# EAGLE board booz_main (EAGLE 6.1)
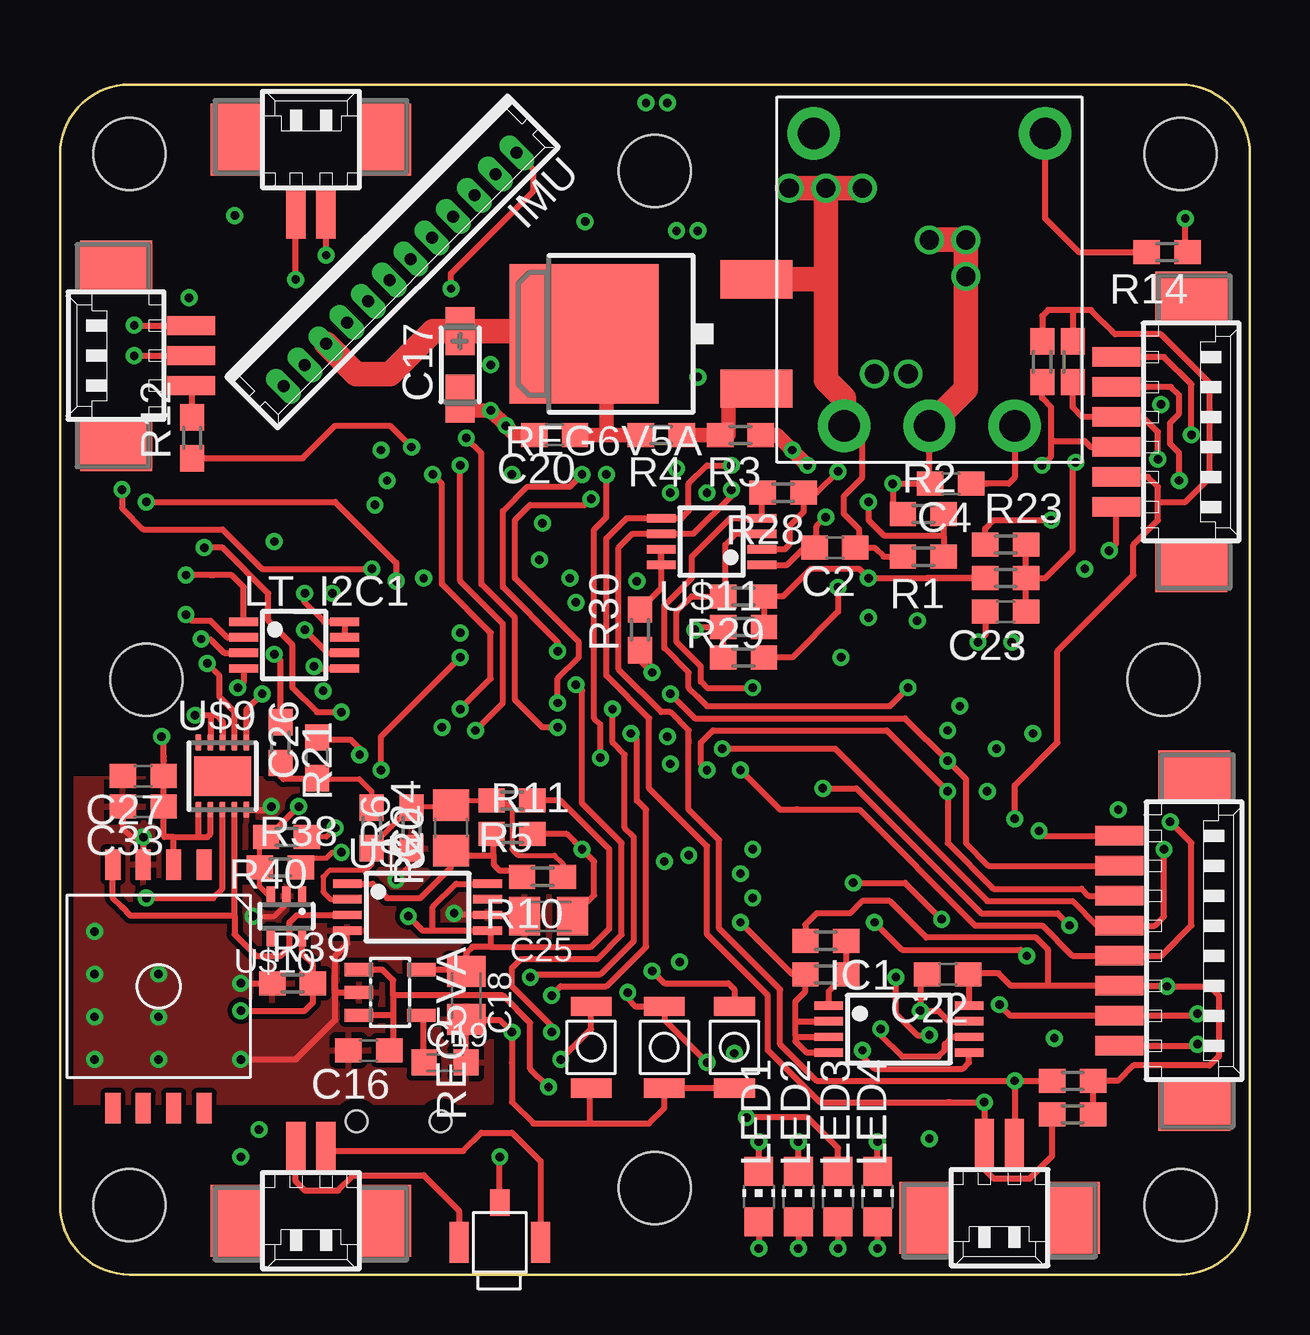
[diagram p3: board, top side]
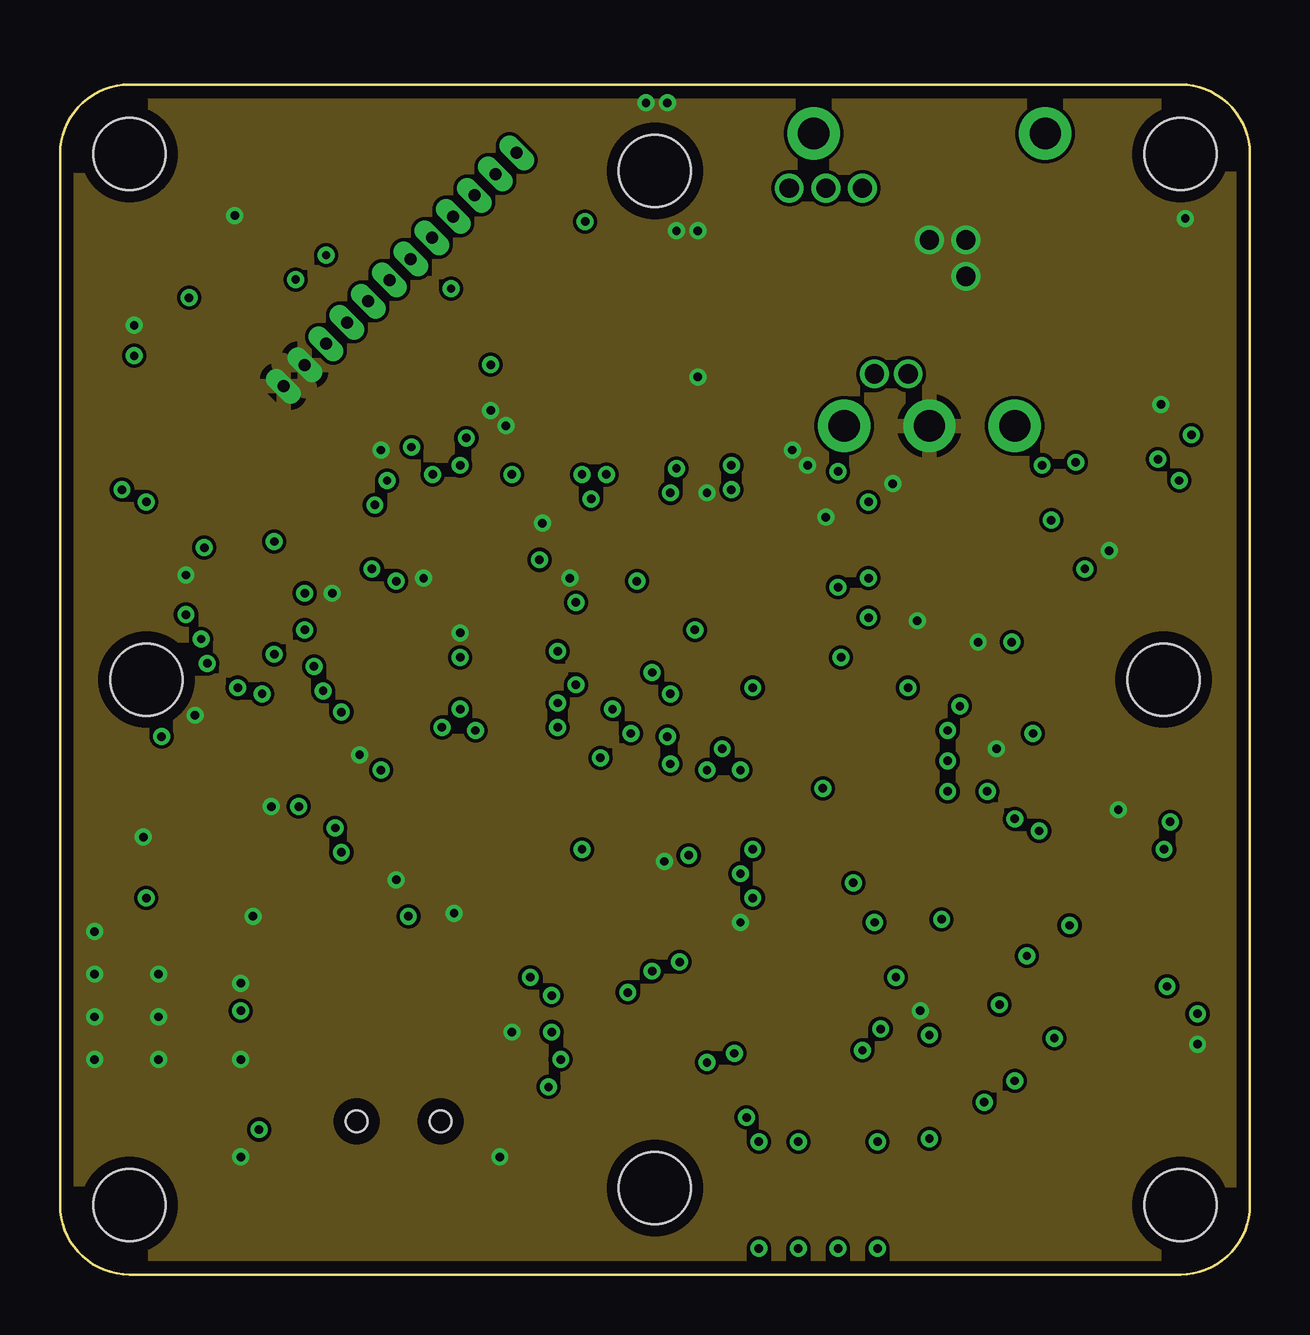
[diagram p4: board, inner layer Route2]
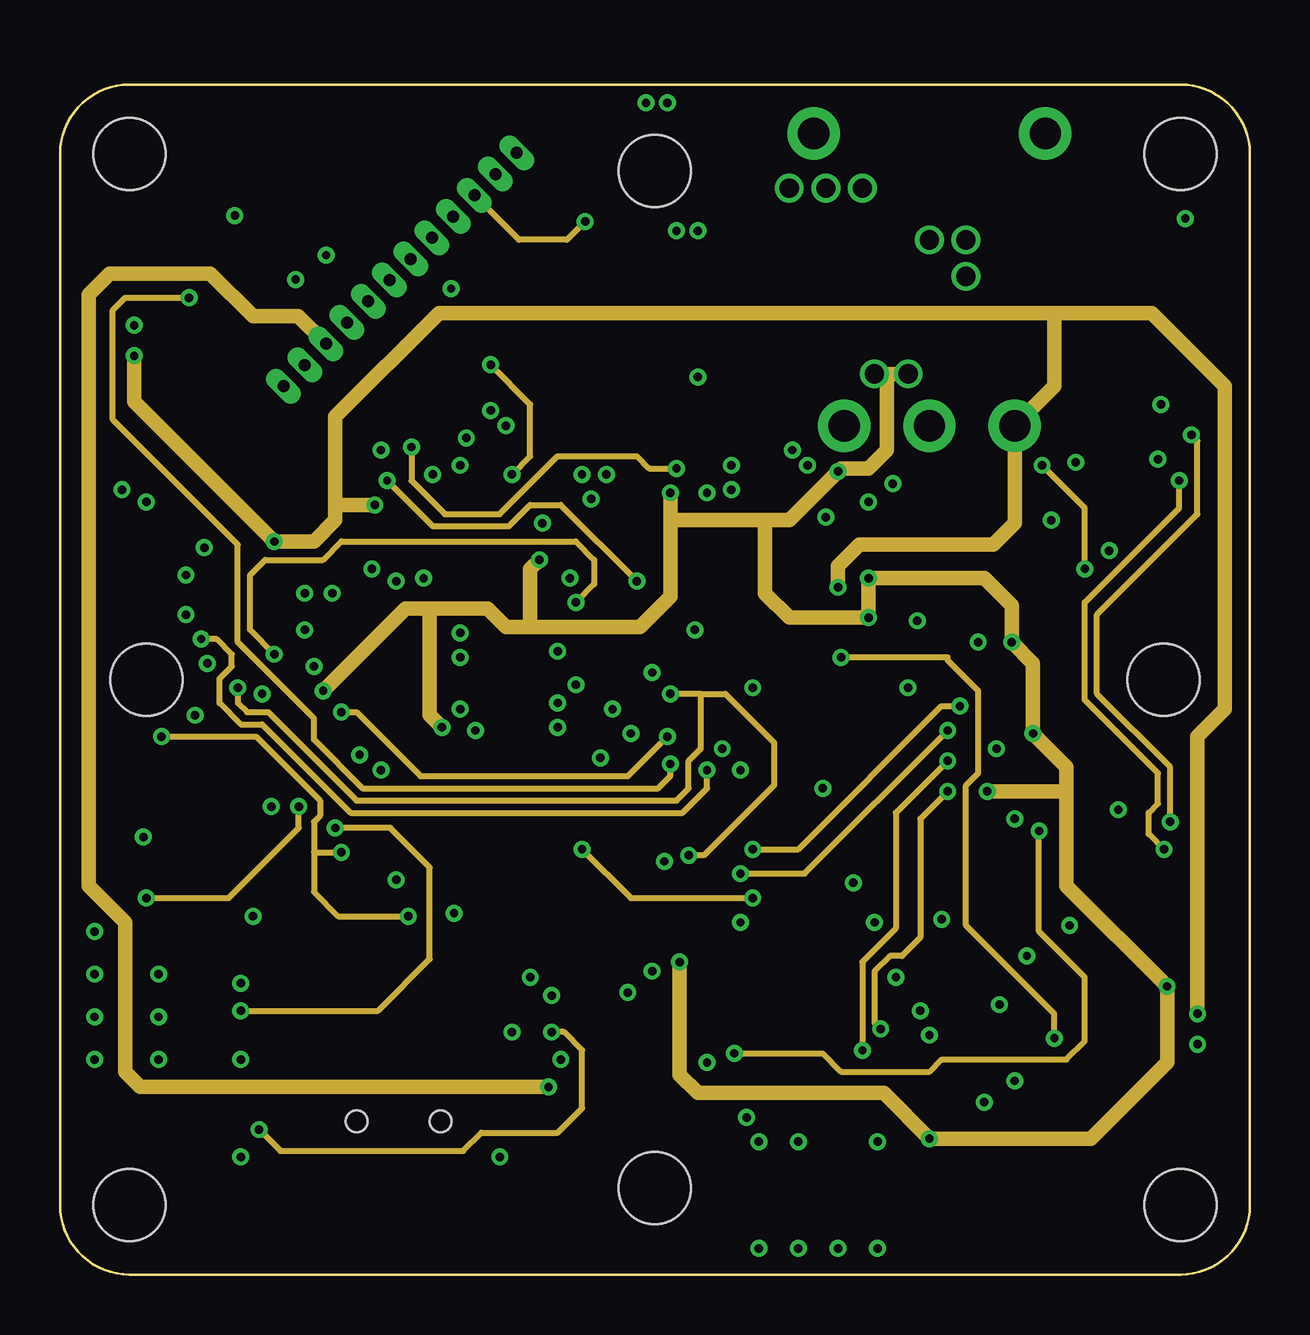
[diagram p5: board, inner layer Route15]
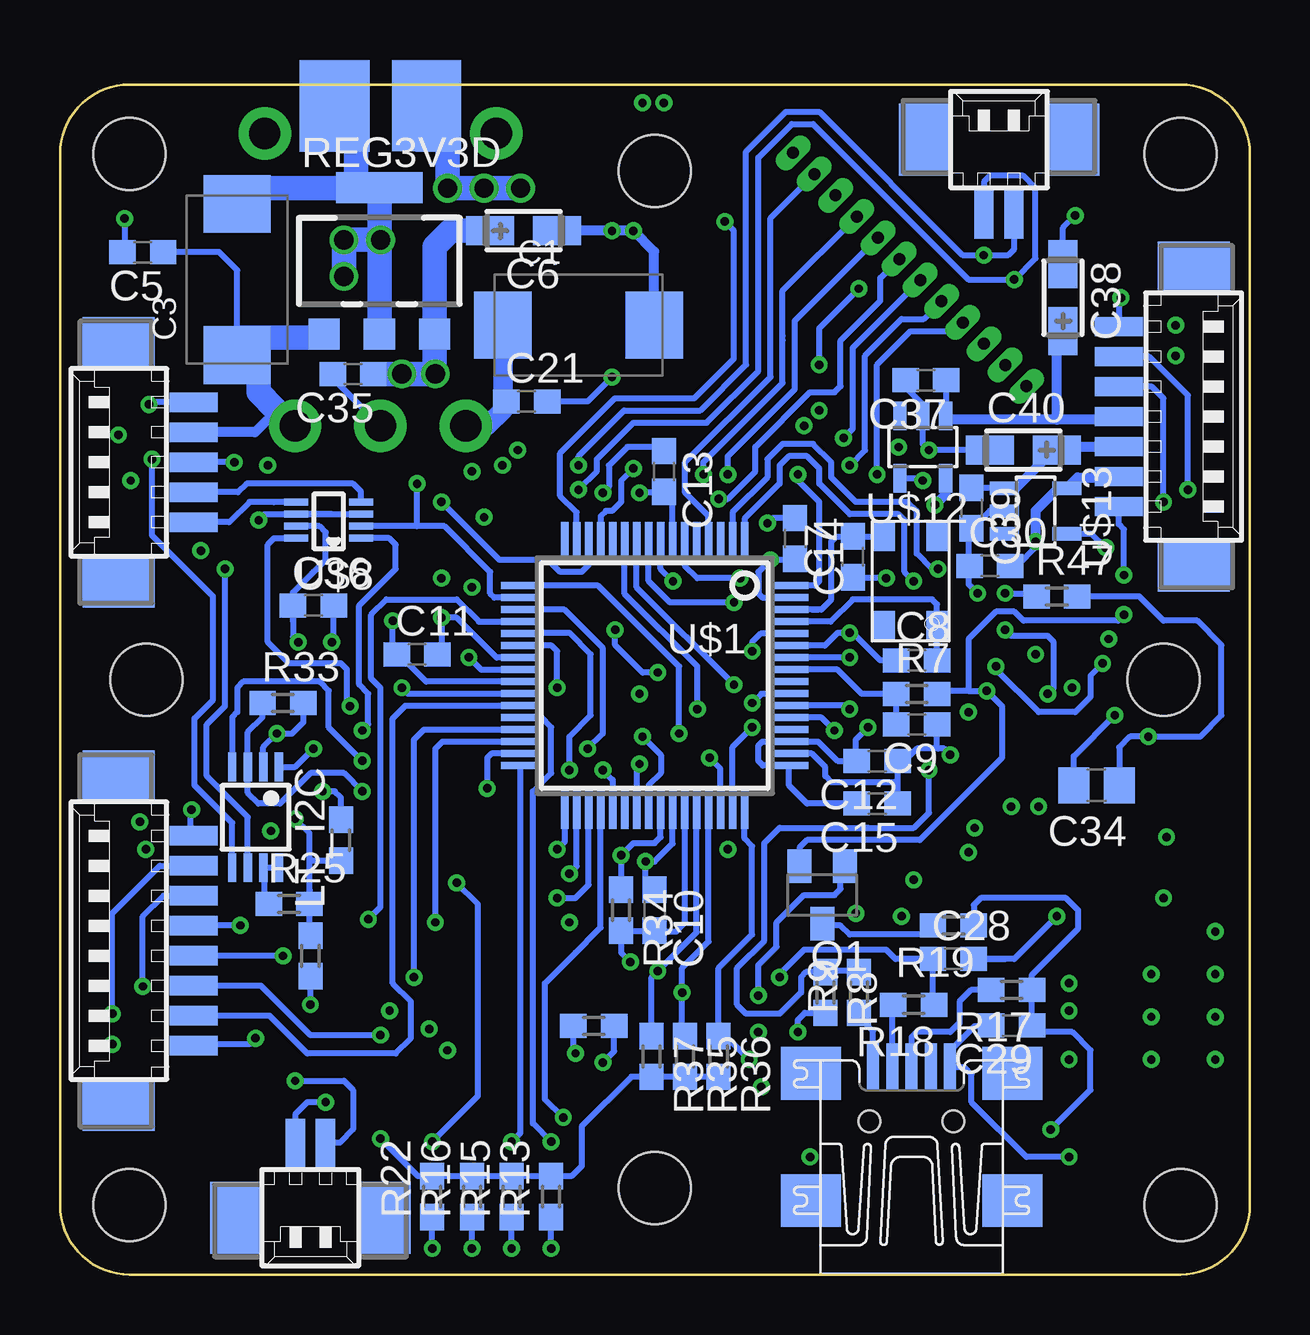
[diagram p6: board, bottom side, seen from below]

Size 49.6 x 49.6 mm. Coordinates in mm from the lower left corner, seen from the top.
Outline: 0,2.9 0,46.7 arc-90 2.9,49.6 46.7,49.6 arc-90 49.6,46.7 49.6,2.9 arc-90 46.7,0 2.9,0 arc-90 0,2.9
Copper layers (1*2+15*16): Top 0.035mm / dielectric 0.2mm / Route2 0.035mm / dielectric 1.5mm / Route15 0.035mm / dielectric 0.2mm / Bottom 0.035mm
Design rules: minimum track width 0.15mm, minimum drill 0.35mm, track to track 0.15mm, track to pad 0.15mm, pad to pad 0.15mm, via to via 0.15mm, smd to smd 0.15mm, copper to edge 20mil, drill to drill 8mil, minimum pad ring 0.177mm, minimum via ring 0.177mm, stop-mask expansion 4mil, vias tented up to drill 14mil, thermal gap 10mil
Holes 3 mm at 2.9,46.7 46.7,46.7 2.9,2.9 46.7,2.9 24.8,46 46,24.8 24.8,3.6 3.6,24.8
bKeepout: area 36.8,36.8 to 42.8,42.8; area 36.8,6.8 to 42.8,12.8; area 6.8,6.8 to 12.8,12.8; area 6.8,36.8 to 12.8,42.8
tRestrict: area -0.2,43.6 to 6,49.8; area 43.7,43.7 to 49.9,49.9; area 43.6,-0.2 to 49.8,6; area -0.2,-0.2 to 6,6; area 21.7,43 to 27.9,49.2; area 42.9,21.7 to 49.1,27.9; area 0.5,21.7 to 6.7,27.9; area 21.8,0.7 to 28,6.9

## Footprints (pad centres in the part's own frame; a part is rotated, then mirrored left to right if it is on the bottom)
SOLD_PAD_150_75 = smd 3.81 x 1.905: P$1 0,0
SMC_D = smd 2.4 x 2.8: + -3.15,0; - 3.15,0
C0603 = smd 1.1 x 1: 1 -0.85,0; 2 0.85,0
CT3216 = smd 2 x 1.2: + 1.4,0; - -1.4,0
C0805K = smd 1.3 x 1.6: 1 -1,0; 2 1,0
C0603K = smd 1.05 x 1.08: 1 -0.875,0; 2 0.875,0
C0805 = smd 1.3 x 1.5: 1 -0.95,0; 2 0.95,0
53261-07 = smd 0.8 x 2: 1 3.75,-2.5; 2 2.5,-2.5; 3 1.25,-2.5; 4 0,-2.5; 5 -1.25,-2.5; 6 -2.5,-2.5; 7 -3.75,-2.5 | smd 2.1 x 3: S1 6.25,0.625; S2 -6.25,0.625
53261-08 = smd 0.8 x 2: 1 4.375,-2.5; 2 3.125,-2.5; 3 1.875,-2.5; 4 0.625,-2.5; 5 -0.625,-2.5; 6 -1.875,-2.5; 7 -3.125,-2.5; 8 -4.375,-2.5 | smd 2.1 x 3: S1 6.875,0.625; S2 -6.875,0.625
TSSOP8 = smd 0.35 x 1.2: 1 -0.975,-2.925; 2 -0.325,-2.925; 3 0.325,-2.925; 4 0.975,-2.925; 5 0.975,2.925; 6 0.325,2.925; 7 -0.325,2.925; 8 -0.975,2.925
53047-12 = drill 0.5 pad 0.698 long: 1 6.875,0.45; 2 5.625,0.45; 3 4.375,0.45; 4 3.125,0.45; 5 1.875,0.45; 6 0.625,0.45; 7 -0.625,0.45; 8 -1.875,0.45; 9 -3.125,0.45; 10 -4.375,0.45; 11 -5.625,0.45; 12 -6.875,0.45
CHIP-LED0805 = smd 1.2 x 1.2: A 0,-1.05; C 0,1.05
TSSOP_B3 = smd 1.2 x 0.35: 1 -2.925,0.975; 2 -2.925,0.325; 3 -2.925,-0.325; 4 -2.925,-0.975; 5 1.275,-0.975; 6 1.275,-0.325; 7 1.275,0.325; 8 1.275,0.975
53261-02 = smd 0.8 x 2: 1 0.625,-2.5; 2 -0.625,-2.5 | smd 2.1 x 3: S1 3.125,0.625; S2 -3.125,0.625
SC59-BEC = smd 1 x 1.4: B -0.95,-1.2; C 0,1.2; E 0.95,-1.2
R0603 = smd 1.1 x 1: 1 -0.85,0; 2 0.85,0
53261-03 = smd 0.8 x 2: 1 1.25,-2.5; 2 0,-2.5; 3 -1.25,-2.5 | smd 2.1 x 3: S1 3.75,0.625; S2 -3.75,0.625
SOT223-R = smd 1.3 x 1.3: 1 -2.3,-3.05; 2 0,-3.05; 3 2.3,-3.05 | smd 3.6 x 1.3: 4 0,3.05
SOT23-5 = smd 0.55 x 1.2: 1 -0.95,-1.3; 2 0,-1.3; 3 0.95,-1.3; 4 0.95,1.3; 5 -0.95,1.3
PTH_TH = drill 1.3 pad 2.184: P$1 -6.096,3.556; P$2 -6.096,0; P$3 -6.096,-3.556; P$4 6.096,-4.826; P$5 6.096,4.826
DPACK = smd 1.6 x 3: 1 -2.28,-4.8; 3 2.28,-4.8 | smd 5.8 x 6.2: 4 0,2.38
SQFP-S-10X10-64 = smd 0.3 x 1.6: 1 -3.75,-5.6; 2 -3.25,-5.6; 3 -2.75,-5.6; 4 -2.25,-5.6; 5 -1.75,-5.6; 6 -1.25,-5.6; 7 -0.75,-5.6; 8 -0.25,-5.6; 9 0.25,-5.6; 10 0.75,-5.6; 11 1.25,-5.6; 12 1.75,-5.6; 13 2.25,-5.6; 14 2.75,-5.6; 15 3.25,-5.6; 16 3.75,-5.6; 33 3.75,5.6; 34 3.25,5.6; 35 2.75,5.6; 36 2.25,5.6; 37 1.75,5.6; 38 1.25,5.6; 39 0.75,5.6; 40 0.25,5.6; 41 -0.25,5.6; 42 -0.75,5.6; 43 -1.25,5.6; 44 -1.75,5.6; 45 -2.25,5.6; 46 -2.75,5.6; 47 -3.25,5.6; 48 -3.75,5.6 | smd 1.6 x 0.3: 17 5.6,-3.75; 18 5.6,-3.25; 19 5.6,-2.75; 20 5.6,-2.25; 21 5.6,-1.75; 22 5.6,-1.25; 23 5.6,-0.75; 24 5.6,-0.25; 25 5.6,0.25; 26 5.6,0.75; 27 5.6,1.25; 28 5.6,1.75; 29 5.6,2.25; 30 5.6,2.75; 31 5.6,3.25; 32 5.6,3.75; 49 -5.6,3.75; 50 -5.6,3.25; 51 -5.6,2.75; 52 -5.6,2.25; 53 -5.6,1.75; 54 -5.6,1.25; 55 -5.6,0.75; 56 -5.6,0.25; 57 -5.6,-0.25; 58 -5.6,-0.75; 59 -5.6,-1.25; 60 -5.6,-1.75; 61 -5.6,-2.25; 62 -5.6,-2.75; 63 -5.6,-3.25; 64 -5.6,-3.75
CASE_1317 = smd 1.27 x 0.635: P$1 5.08,-1.905; P$2 5.08,-0.635; P$3 5.08,0.635; P$4 5.08,1.905; P$5 -5.08,1.905; P$6 -5.08,0.635; P$7 -5.08,-0.635; P$8 -5.08,-1.905
B3U-3100P = smd 0.8 x 1.1: GND 0,-1.65 | smd 0.8 x 1.7: P$1 -1.7,0; P$2 1.7,0
CTS_CRYSTAL = smd 1.2 x 0.9: P$1 -1.85,-1.1; P$2 1.85,-1.1; P$3 1.85,1.1; P$4 -1.85,1.1
B3U-1000P = smd 0.8 x 1.7: P$1 -1.7,0; P$2 1.7,0
US8 = smd 0.3 x 1: 1 -0.75,-1.35; 2 -0.25,-1.35; 3 0.25,-1.35; 4 0.75,-1.35; 5 0.75,1.35; 6 0.25,1.35; 7 -0.25,1.35; 8 -0.75,1.35
DFN10 = smd 0.25 x 0.675: 1 -1,-1.4; 2 -0.5,-1.4; 3 0,-1.4; 4 0.5,-1.4; 5 1,-1.4; 6 1,1.4; 7 0.5,1.4; 8 0,1.4; 9 -0.5,1.4; 10 -1,1.4 | smd 2.38 x 1.65: 11 0,0
SC70-5L = smd 0.35 x 0.8: 1 -0.65,-0.85; 2 0,-0.85; 3 0.65,-0.85; 4 0.65,0.85; 5 -0.65,0.85
SOT23-5L = smd 0.55 x 1.2: 1 -0.95,-1.3; 2 0,-1.3; 3 0.95,-1.3; 4 0.95,1.3; 5 -0.95,1.3
53261-06 = smd 0.8 x 2: 1 3.125,-2.5; 2 1.875,-2.5; 3 0.625,-2.5; 4 -0.625,-2.5; 5 -1.875,-2.5; 6 -3.125,-2.5 | smd 2.1 x 3: S1 5.625,0.625; S2 -5.625,0.625
53261-05 = smd 0.8 x 2: 1 2.5,-2.5; 2 1.25,-2.5; 3 0,-2.5; 4 -1.25,-2.5; 5 -2.5,-2.5 | smd 2.1 x 3: S1 5,0.625; S2 -5,0.625
UX60-MB-5ST = smd 2 x 0.5: 1 2.25,1.6; 2 2.25,0.8; 3 2.25,0; 4 2.25,-0.8; 5 2.25,-1.6 | smd 2.2 x 2.5: M1 -3.3,-4.2; M2 -3.3,4.2; M3 2,4.2; M4 2,-4.2 | hole 0.9: 0,-1.75; 0,1.75

## Placement (x,y rotation side)
BAT_IN  SOLDER_PAD150_75  [SOLD_PAD_150_75]  34.8,48.72 270 bottom
BAT_IN1  SOLDER_PAD150_75  [SOLD_PAD_150_75]  33.83,48.71 270 bottom
C1  100uF/20V  [SMC_D]  27.98,39.57 0 bottom
C2  100nF  [C0603]  32.3,30.3 180 top
C3  220uF/10V  [SMC_D]  42.21,41.47 90 bottom
C4  100nF  [C0603]  37.13,32.97 180 top
C5  100nF  [C0603]  46.15,42.62 180 bottom
C6  33uF/6V  [CT3216]  30.27,43.51 180 bottom
C7  18pF  [C0603]  16.55,29.92 90 bottom
C8  18pF  [C0603]  13.89,25.6 0 bottom
C9  100nF  [C0603]  13.89,22.93 180 bottom
C10  100nF  [C0603]  24.81,15.19 270 bottom
C11  100nF  [C0603]  34.72,25.85 0 bottom
C12  100nF  [C0603]  15.54,21.41 180 bottom
C13  100nF  [C0603]  24.43,33.47 270 bottom
C14  100nF  [C0603]  18.97,30.68 270 bottom
C15  100nF  [C0603]  15.54,19.63 180 bottom
C16  2.2uF/Low ESR  [C0603]  12.87,9.34 180 top
C17  22uF/10V  [CT3216]  16.68,37.92 90 top
C18  4.7uF/10V/Low ESR  [C0805K]  16.94,11.63 270 top
C19  10nF/16V  [C0603K]  16.05,8.84 0 top
C20  100nF  [C0603]  20.62,35 180 top
C21  100nF  [C0603]  30.14,36.39 0 bottom
C22  100nF  [C0603]  37,12.52 180 top
C23  100nF  [C0603]  39.41,27.63 180 top
C24  1.5uF  [C0805]  16.3,18.61 90 top
C25  33nF  [C0805K]  20.36,14.93 180 top
C26  100nF  [C0603]  10.71,21.54 90 top
C27  100nF  [C0603]  3.47,20.77 180 top
C28  18pF  [C0603]  12.36,13.15 0 bottom
C29  18pF  [C0603]  9.94,10.39 180 bottom
C30  100nF  [C0603]  10.84,29.54 0 bottom
C33  100nF  [C0603]  3.47,19.5 180 top
C34  1.5uF  [C0805]  6.39,20.39 180 bottom
C35  100nF  [C0603]  37.38,37.54 180 bottom
C36  100nF  [C0603]  39.03,27.89 0 bottom
C37  100nF  [C0603]  13.51,37.28 180 bottom
C38  33uF/6V  [CT3216]  7.79,40.71 270 bottom
C39  100nF  [C0603]  11.6,31.95 270 bottom
C40  33uF/6V  [CT3216]  9.44,34.36 0 bottom
CAM  53261-07  [53261-07]  2.97,35.76 270 bottom
GND_IN  SOLDER_PAD150_75  [SOLD_PAD_150_75]  37.64,48.71 270 bottom
GND_IN1  SOLDER_PAD150_75  [SOLD_PAD_150_75]  38.65,48.71 90 bottom
GPS  53261-08  [53261-08]  46.65,13.92 270 top
IC1  24AA128ST  [TSSOP8]  34.97,10.23 270 top
IMU  53047-12  [53047-12]  13.86,42.21 225 top
LED1  RED  [CHIP-LED0805]  29.13,3.25 0 top
LED2  RED  [CHIP-LED0805]  30.78,3.25 0 top
LED3  RED  [CHIP-LED0805]  32.43,3.25 0 top
LED4  RED  [CHIP-LED0805]  34.08,3.25 0 top
LT_I2C  PCA9306DP  [TSSOP_B3]  41.45,18.23 270 bottom
LT_I2C1  PCA9306DP  [TSSOP_B3]  10.59,26.24 0 top
MC1  53261-02  [53261-02]  39.16,2.99 180 bottom
MC2  53261-02  [53261-02]  39.16,2.99 180 top
MC3  53261-02  [53261-02]  10.46,46.68 0 top
MC4  53261-02  [53261-02]  10.46,46.68 0 bottom
PS  53261-02  [53261-02]  10.46,2.87 180 top
Q1  DDTA143  [SC59-BEC]  17.83,15.82 180 bottom
R1  4.7k  [R0603]  35.99,29.92 180 top
R2  1k  [R0603]  35.99,31.7 0 top
R3  3.9k  [R0603]  28.37,35 180 top
R4  1k  [R0603]  25.06,35 180 top
R5  390R  [R0603]  18.84,19.76 180 top
R6  12K  [R0603]  14.65,18.61 90 top
R7  10k  [R0603]  13.89,24.2 0 bottom
R8  3.3k  [R0603]  17.7,11.76 270 bottom
R9  1.8k  [R0603]  16.3,11.76 90 bottom
R10  27K  [R0603]  20.11,16.58 180 top
R11  120k  [R0603]  18.84,18.36 0 top
R12  100R  [R0603]  5.51,34.87 90 top
R13  1k  [R0603]  29.13,3.25 90 bottom
R14  348R  [R0603]  46.15,42.62 180 top
R15  1k  [R0603]  30.78,3.25 90 bottom
R16  1k  [R0603]  32.43,3.25 90 bottom
R17  33R  [R0603]  9.94,11.86 180 bottom
R18  33R  [R0603]  14.02,11.25 180 bottom
R19  1.5k  [R0603]  12.36,14.55 180 bottom
R20  560R  [R0603]  13,18.61 270 top
R21  680R  [R0603]  9.19,22.17 270 top
R22  1k  [R0603]  34.08,3.25 90 bottom
R23  100  [R0603]  39.41,30.43 0 top
R24  0/DNP  [R0603]  39.41,29.03 0 top
R25  200k  [R0603]  40.05,15.44 0 bottom
R26  0/DNP  [R0603]  37.89,18.11 270 bottom
R27  0/DNP  [R0603]  39.16,13.28 90 bottom
R28  4.7k  [R0603]  30.14,32.58 180 top
R29  4.7k  [R0603]  28.49,28.27 180 top
R30  200k  [R0603]  24.17,26.87 90 top
R31  0/DNP  [R0603]  28.49,27 180 top
R32  0/DNP  [R0603]  28.49,25.73 180 top
R33  4.7k  [R0603]  40.3,23.82 0 bottom
R34  4.7k  [R0603]  26.21,15.19 270 bottom
R35  10k  [R0603]  23.54,9.09 270 bottom
R36  10k  [R0603]  22.14,9.09 270 bottom
R37  10k  [R0603]  24.94,9.09 270 bottom
R38  RS  [R0603]  9.19,16.96 0 top
R39  R2  [R0603]  9.7,12.14 0 top
R40  R1  [R0603]  9.44,18.23 180 top
R41  0/DNP  [R0603]  31.92,13.92 0 top
R42  0/DNP  [R0603]  31.92,12.52 0 top
R43  4.7k  [R0603]  42.21,38.05 90 top
R44  4.7k  [R0603]  40.94,38.05 90 top
R45  4.7k  [R0603]  42.21,8.07 180 top
R46  4.7k  [R0603]  42.21,6.68 180 top
R47  200k  [R0603]  8.05,28.27 0 bottom
R48  0/DNP  [R0603]  27.35,10.36 180 bottom
RC  53261-03  [53261-03]  2.97,38.3 90 top
REG3V3D  LM3940IMP-3.3  [SOT223-R]  36.29,42.25 0 bottom
REG5VA  LP2992  [SOT23-5]  13.76,11.76 270 top
REG5VD  PTHTH  [PTH_TH]  36.24,41.47 90 top
REG6V5A  LM317MBDT  [DPACK]  24.22,39.21 90 top
SPI_0  53261-08  [53261-08]  46.53,13.92 90 bottom
U$1  LPC2148  [SQFP-S-10X10-64]  24.81,24.96 180 bottom
U$2  MPX6115  [CASE_1317]  4.11,12.01 90 top
U$3  SW_PB_GNDRT/A  [B3U-3100P]  18.33,1.34 180 top
U$4  CRYSTAL_CTS  [CTS_CRYSTAL]  14.14,28.9 270 bottom
U$5  AD8552RU  [TSSOP8]  14.9,15.31 270 top
U$6  SW_PBST  [B3U-1000P]  25.19,9.47 270 top
U$7  SW_PBST  [B3U-1000P]  22.14,9.47 270 top
U$8  TXS0102DCU  [US8]  38.4,31.44 90 bottom
U$9  LTC2485  [DFN10]  6.78,20.77 0 top
U$10  LM4041SC70  [SC70-5L]  9.44,14.93 180 top
U$11  PCA9306DP  [TSSOP_B3]  26.33,30.55 180 top
U$12  TPS2051B  [SOT23-5L]  13.63,34.49 180 bottom
U$13  TPS2051B  [SOT23-5L]  8.94,31.82 270 bottom
U$14  SW_PBST  [B3U-1000P]  28.11,9.47 270 top
UART_0  53261-06  [53261-06]  46.53,35.12 270 top
UART_1  53261-05  [53261-05]  46.53,33.86 90 bottom
USB  MINI-USB-UX60-MB-5ST  [UX60-MB-5ST]  14.1,6.38 90 bottom

## Tracks (layer width: path | path; a pad name or v marks a point on that pad's centre or on a via)
+3V3  (via drill 0.35, 0.8)
  Top 0.254: R31.1 29.34,28.23 29.38,28.27 R29.1 30.14,28.27 31.29,29.41 33.32,29.41 v33.7,29.03 R24.1 36.11,29.03 | U$11.2 30.2,30.23 30.4,30.43 30.4,31.19 30.99,31.78 R28.1 31.54,32.58 v32.43,33.47 | 37.89,12.56 IC1.8 | 37.89,12.56 C22.1 | 41.19,12.04 GPS.3 44.18,12.01 v46.15,12.01 47.92,12.01 48.3,11.63 48.3,9.09 47.92,8.71 44.75,8.71 44.11,8.07 R45.1 R46.1 | 41.19,12.04 39.64,12.04 39.12,12.56 37.89,12.56 | R41.1 31.07,14.59 31.54,15.06 32.94,15.06 33.45,15.57 34.59,15.57 36.11,14.04 40.69,14.04 41.19,13.54 41.19,12.04 | LT_I2C1.2 6.96,26.56 6.27,27.25 5.51,27.25 v5.25,27.5
  Route15 0.61: 41.95,17.35 41.95,20.14 | 41.95,17.35 41.95,17.22 | 41.95,20.14 41.95,21.15 v40.56,22.55 40.56,25.47 v39.67,26.36 39.67,27.89 38.53,29.03 v33.7,29.03 v33.7,27.38 30.4,27.38 29.38,28.39 29.38,31.44 | 41.95,20.14 v38.65,20.14 | 29.38,31.44 25.44,31.44 | 29.38,31.44 30.4,31.44 v32.43,33.47 32.56,33.6 33.7,33.6 34.46,34.36 34.46,37.54 v33.95,37.54 v35.35,37.54 | 25.44,31.44 25.44,28.27 24.17,27 19.6,27 | 25.44,31.44 v25.44,32.58 | 41.95,17.35 41.95,16.2 v46.15,12.01 46.15,8.84 42.97,5.66 v36.24,5.66 34.33,7.57 26.59,7.57 25.83,8.33 v25.83,13.03 | 19.6,27 19.6,29.41 v19.98,29.79 | v10.97,24.33 14.4,27.76 15.41,27.76 | 15.41,27.76 17.83,27.76 18.59,27 19.6,27 | v15.92,22.81 15.41,23.31 15.41,27.76
  Bottom 0.254: 16.43,21.41 17.19,21.41 18,22.21 U$1.51 20.32,22.21 20.49,22.04 20.49,21.41 20.3,21.21 U$1.49 19.21,20.38 18.46,19.63 C15.2 | LT_I2C.2 41.12,21.99 v40.56,22.55 39.92,22.55 39.45,23.02 R33.2 | 30.42,25.73 U$1.23 31.4,25.71 33.06,27.38 v33.7,27.38 33.7,26.02 C11.2 | U$1.43 23.54,19.38 23.54,14.68 23.92,14.3 24.81,14.3 | 24.43,32.58 C13.2 | U$1.7 24.06,32.22 24.43,32.58 | 16.43,21.41 C12.2 | v15.92,22.81 16.43,22.3 16.43,21.41 | R15.2 R13.2 28.28,4.1 27.86,4.52 27.86,6.17 25.79,8.24 R37.2 R35.2 R36.2 | R15.2 R16.2 R22.2 | 24.43,32.58 v25.44,32.58 | R15.2 30.78,3.76 30.74,3.72 | R22.2 34.08,3.76 34.04,3.72 | 39.03,29.28 38.53,29.79 38.53,30.93 38.78,31.19 U$8.7 | 39.03,29.28 39.12,29.2 | C10.2 24.81,14.3 | Q1.E 18.77,17.79 18.46,18.11 13.76,18.11 10.33,21.54 10.33,23.7 v10.97,24.33 11.73,24.33 | 26.21,14.3 R34.2 | 24.81,14.3 26.21,14.3 | 39.88,27.23 39.88,26.58 v39.67,26.36 | C36.1 39.88,27.23 | SPI_0.3 45.29,15.79 46.15,14.93 v46.15,12.01 | 39.88,27.23 39.88,28.43 39.03,29.28 | U$1.63 20.31,28.21 20.49,28.39 20.49,29.28 v19.98,29.79 19.01,29.79 arc-90 C14.2 | R7.2 12.91,24.33 11.73,24.33 | v5.25,27.5 5.51,27.25 9.44,27.25 9.82,27.63 10.59,27.63 11.73,26.49 11.73,24.33 | R22.2 34.68,4.1 v36.24,5.66 | R26.1 37.89,19.89 38.14,20.14 v38.65,20.14 | 26.21,14.3 26.21,13.41 v25.83,13.03
  Bottom 0.813: v33.95,37.54 33.99,37.57 | v35.35,37.54 34.72,37.54
  Bottom 1.016: 33.99,37.57 REG3V3D.3 33.99,42.84 33.32,43.51 C6.+ | v33.95,37.54 34.72,37.54 C35.1
+5V  (via drill 0.35)
  Top 0.254: R32.1 30.52,25.73 32.43,27.63 v32.43,28.65 | REG5VD.P$3 39.8,33.22 39.54,32.97 C4.1 38.65,32.97 | v3.09,38.3 RC.2 | v47.42,10.87 47.34,10.79 GPS.2 39.62,10.79 v39.16,11.25
  Route15 0.61: v3.09,38.3 3.09,36.39 v8.94,30.55 10.59,30.55 11.47,31.44 11.47,32.08 | v47.42,10.87 47.42,22.43 48.56,23.57 48.56,37.03 45.51,40.08 41.45,40.08 | 11.47,32.08 11.47,35.76 15.79,40.08 41.45,40.08 | v32.43,28.65 32.43,29.54 33.32,30.43 38.91,30.43 39.8,31.32 REG5VD.P$3 | 11.47,32.08 v13.13,32.08 | REG5VD.P$3 | REG5VD.P$3 | REG5VD.P$3 41.45,37.03 41.45,40.08
  Bottom 0.254: 5.39,33.22 CAM.2 | v39.16,11.25 R27.1 | U$13.5 7.98,32.77 | C30.2 9.7,29.54 8.94,30.3 v8.94,30.55 | v47.42,10.87 47.42,15.06 45.43,17.04 SPI_0.2 | C5.1 42.97,42.62 42.21,41.86 42.21,39.06 | 40.43,36.14 40.56,36.14 40.62,36.08
  Bottom 0.406: U$13.5 7.19,33.22 5.39,33.22 | 7.98,32.77 8.94,31.82 v8.94,30.55 | U$12.5 12.68,32.52 v13.13,32.08 | 40.62,36.08 40.56,36.01 | UART_1.2 41.47,35.11 40.43,36.14 | 41.32,38.33 41.68,38.33 41.83,38.17
  Bottom 1.016: 38.53,39.19 38.59,39.19 REG3V3D.1 38.59,39.06 42.21,39.06 C3.+ 41.32,38.33 41.32,36.78 40.62,36.08 39.92,35.38 REG5VD.P$3
+5VA  (via drill 0.35)
  Top 0.203: v11.73,17.6 11.35,17.6 11.09,17.35 10.46,17.35 10.08,16.96 R38.2
  Top 0.254: 5.25,18.23 5.28,18.23 | 5.25,18.23 5.76,18.23 | 4.74,18.23 4.36,18.23 4.32,18.27 4.32,19.12 | 4.74,18.23 5.25,18.23 | 16.94,13.41 16.97,13.45 | 4.32,19.12 C33.1 | C33.1 C27.1 4.32,21.41 | 4.32,19.12 4.36,19.12 4.32,19.16 C33.1 | 4.32,21.41 4.32,21.57 | 4.32,21.41 4.32,22.34 v4.24,22.43 | 5.76,18.23 6.14,18.23 6.28,18.37 U$9.2 | U$9.1 5.78,18.25 5.76,18.23 | REG5VA.5 16.37,12.71 16.68,12.39 16.94,12.65 | 17.44,13.66 17.19,13.66 16.94,13.41 | 17.44,13.66 17.45,13.67 | U$2.P$2 4.74,18.23 | 17.95,13.66 17.44,13.66 | 17.95,13.66 22.14,13.66 22.91,14.42 22.91,17.73 20.87,19.76 R5.1 | U$5.8 16.51,16.29 15.54,15.31 15.54,14.34 | 15.54,14.34 15.12,14.34 v14.52,14.93 | 15.54,14.34 U$5.5 17.95,14.34 17.95,13.66 | 16.94,13.41 16.94,12.65 | 16.94,12.65 C18.1
  Route15 0.254: v4.24,22.43 8.17,22.43 10.84,19.76 10.84,19.12 10.59,18.87 10.59,17.6 | 10.59,17.6 v11.73,17.6 | 10.59,17.6 10.59,15.95 11.6,14.93 v14.52,14.93
  Bottom 0.254: C34.1 5.45,21.98 5,22.43 v4.24,22.43 2.08,22.43 1.19,23.31 1.19,26.24 2.2,27.25 3.6,27.25 4.62,28.27 R47.2
+6V5  (via drill 0.35)
  Top 0.254: REG5VA.1 13.45,12.71 13.89,12.27 13.89,11.63 | REG5VA.3 13.83,10.81 13.89,10.87 | 13.89,11.63 18.46,11.63 19.6,10.49 19.6,8.58 v20.36,7.82 | C16.1 13.76,9.34 13.89,9.47 13.89,10.87 | 13.89,11.63 13.89,10.87
  Top 0.61: 21.93,38.9 21.84,38.98 REG6V5A.4 21.84,39.14 21.76,39.06 21.38,39.44 20.24,40.59 | 22.65,35 22.78,35 22.78,38.05 | 22.65,35 C20.1 | 22.65,35 R4.2
  Top 0.813: C20.1 21.38,35 | 21.93,38.9 22.78,38.05
  Top 1.016: 21.38,39.44 21.26,39.32 C17.+ 15.54,39.32 13.76,37.54 12.34,37.54 IMU.3
  Route15 0.61: IMU.3 9.93,39.95 8.05,39.95 6.27,41.73 2.08,41.73 1.19,40.84 1.19,16.2 2.71,14.68 2.71,8.46 3.35,7.82 v20.36,7.82
+12V  (via drill 0.8)
  Top 0.254: C2.1 33.32,30.3 | 33.32,30.3 33.95,30.3 34.33,29.92 R1.2 | 33.32,30.3 33.32,31.06 32.68,31.7 32.68,32.46 33.45,33.22 33.45,34.74 32.68,35.51 | REG5VD.P$1
  Top 0.406: 32.68,35.51 REG5VD.P$1
  Top 1.016: REG5VD.P$1 32.69,36.52 31.92,37.28 31.92,41.47 | REG6V5A.3 31.91,41.49 31.92,41.47 | 31.92,41.47 v31.92,45.28 | v31.92,45.28 v30.4,45.28 | v31.92,45.28 v33.45,45.28
  Bottom 0.61: 31.13,36.04 31.13,36.27 31.03,36.27 30.99,36.31 C21.1 | REG5VD.P$1
  Bottom 0.813: 31.13,36.27 C1.+ | 31.13,36.04 31.8,35.38 REG5VD.P$1
  Bottom 1.016: v30.4,45.28 v33.45,45.28 33.45,48.21 BAT_IN1.P$1 34.84,48.71 34.84,48.72 BAT_IN.P$1
ADC_SCL  (via drill 0.35)
  Top 0.254: LT_I2C1.6 11.16,25.91 v10.2,26.87 | U$9.6 7.78,23.55 v8.43,24.2
  Bottom 0.254: v8.43,24.2 8.17,24.46 8.17,26.36 8.43,26.62 9.95,26.62 v10.2,26.87
ADC_SDA  (via drill 0.35)
  Top 0.254: LT_I2C1.5 10.67,25.26 v10.59,25.35 | v6.14,25.47 6.65,24.96 6.65,24.08 7.28,23.45 U$9.7
  Bottom 0.254: v6.14,25.47 6.65,24.96 6.65,24.08 7.28,23.44 8.81,23.44 10.59,25.22 v10.59,25.35
ADC_SPARE  (via drill 0.35)
  Route15 0.254: v25.44,21.28 25.44,20.77 24.94,20.27 12.62,20.27 10.59,22.3 10.59,23.19 7.41,26.36 7.41,30.43 2.2,35.63 2.2,40.2 2.71,40.71 v5.38,40.71
  Bottom 0.254: U$1.39 25.56,21.17 v25.44,21.28 | CAM.7 5.47,40.63 v5.38,40.71
BOOT/SDA_1  (via drill 0.35)
  Top 0.254: GPS.7 38.7,17.04 37.76,17.98 37.76,20.65 v37,21.41 35.22,23.19 26.46,23.19 v25.44,24.2 | IC1.5 37.89,8.84 37.64,8.58 33.95,8.58 33.45,9.09 v33.45,9.34 | LT_I2C1.4 7.66,24.71 v7.41,24.46
  Route15 0.254: 26.72,24.2 27.73,24.2 29.76,22.17 29.76,20.39 26.84,17.47 v26.21,17.47 | 26.72,24.2 v25.44,24.2 | 26.72,24.2 26.72,21.92 26.21,21.41 26.21,20.27 25.7,19.76 12.36,19.76 8.68,23.44 7.79,23.44 7.41,23.82 v7.41,24.46 | v33.45,9.34 33.45,13.03 34.84,14.42 34.84,19.25 v37,21.41
  Bottom 0.254: U$1.41 24.56,18.23 24.81,17.98 25.7,17.98 v26.21,17.47 R34.1 | LT_I2C.4 42.42,23.23 42.21,23.44 42.21,24.46 41.95,24.71 38.78,24.71 38.4,24.33 38.4,22.81 v37,21.41
CAM_SW  (via drill 0.35)
  Top 0.254: v11.73,23.44 10.71,23.44 9.7,24.46 9.7,26.24 8.68,27.25 8.68,28.39 6.78,30.3 v6.01,30.3
  Route15 0.254: v11.73,23.44 12.36,23.44 15.03,20.77 23.67,20.77 v25.32,22.43
  Bottom 0.254: U$13.4 6.59,30.87 v6.01,30.3 | v25.32,22.43 24.56,21.66 24.56,20.9 25.06,20.4 U$1.40
DRDY_0  (via drill 0.35)
  Route15 0.254: v32.56,25.73 37,25.73 37,25.6 38.27,24.33 38.27,20.9 37.76,20.39 37.76,14.55 41.45,10.87 v41.45,9.85
  Bottom 0.254: U$1.24 32.05,25.21 v32.56,25.73 | SPI_0.8 44.03,9.51 43.99,9.47 43.86,9.6 41.7,9.6 v41.45,9.85
DRDY_1  (via drill 0.35)
  Top 0.254: v22.78,33.35 22.78,31.57 22.27,31.06 22.27,23.19 22.52,22.93 v22.52,21.54
  Bottom 0.254: U$1.46 22.07,19.38 22.07,21.08 v22.52,21.54 | v22.78,33.35 22.78,33.86 19.48,37.16 19.48,38.94 | 19.48,38.94 19.48,39.13 | IMU.9 19.48,41.01 19.48,38.94
DRDY_2  (via drill 0.35)
  Route15 0.254: v21.89,43.89 21.13,43.13 19.13,43.13 IMU.10
  Bottom 0.254: U$1.15 28.06,31.77 28.75,32.46 28.75,34.24 26.46,36.52 23.16,36.52 21.51,38.17 21.51,43.51 v21.89,43.89
GND  (via drill 0.35, 0.8)
  Top 0.203: U$10.2 9.44,15.44 8.94,14.93 v8.05,14.93
  Top 0.254: 31.03,30.3 C2.2 | U$11.1 30.31,29.58 31.03,30.3 | REG5VD.P$2 36.24,32.97 | RC.1 3.11,39.55 v3.09,39.57 | 36.24,32.97 C4.2 | 31.03,30.3 31.54,30.81 31.54,31.19 v31.92,31.57 | U$3.GND v18.33,4.9 | 22.09,7.77 U$7.P$2 22.14,7.82 22.09,7.77 | U$6.P$2 U$14.P$2 28.19,7.77 | U$6.P$2 28.19,7.77 | 28.19,7.77 28.24,7.82 | 36.24,32.97 v34.72,32.97 34.72,32.12 R2.1 | C25.2 19.09,14.93 19.02,14.86 | C25.2 | C25.2 19.29,14.99 U$5.6 16.5,14.99 v16.43,15.06 | v12.49,21.66 12.49,21.92 12.11,22.3 10.84,22.3 10.71,22.43 C26.2 | v7.54,12.14 R39.1 | U$5.4 11.98,13.79 11.47,13.28 11.47,11.76 | 11.47,11.76 11.47,10.61 9.82,8.96 v7.54,8.96 | 11.47,11.76 REG5VA.2 | C19.2 16.94,8.84 C18.2 16.67,10.61 18.33,10.61 v18.84,10.11 | v14.02,16.46 14.52,16.96 | U$2.P$3 v3.47,18.23 2.97,18.23 2.62,18.58 C33.2 | UART_0.1 44.03,30.47 v43.73,30.17 | U$9.5 8.68,19.37 v8.81,19.5 | R14.1 46.91,42.62 v46.91,44.02 | IC1.7 37.06,10.56 36.62,11 v35.86,11 35.86,12.23 C22.2 | IC1.4 31.12,9.26 30.65,9.72 30.65,9.98 | 30.65,9.98 30.65,10.49 | 30.65,10.49 30.65,11.38 31.07,11.8 R42.1 | IC1.2 30.72,10.56 30.65,10.49 | IC1.3 30.72,9.91 30.65,9.98 | R42.1 30.65,12.52 | v28.37,14.68 30.52,12.52 R42.1 | v18.84,10.11 18.84,8.84 | U$6.P$2 25.19,6.93 24.56,6.3 22.14,6.3 | 22.14,6.3 19.73,6.3 18.84,7.18 v18.84,10.11 | 22.09,7.77 22.09,6.35 22.14,6.3 | U$9.8 6.78,23.06 6.52,23.31 6.27,23.31 | v5.63,23.31 6.27,23.31 | U$9.9 6.28,23.31 6.27,23.31 | 6.27,29.16 6.39,29.16 | 6.27,29.16 v5.25,29.16 | LT_I2C1.1 7.66,28.65 7.16,29.16 6.27,29.16 | GPS.1 47.36,9.54 v47.42,9.6 | C23.2 38.56,26.65 v38.27,26.36
  Top 0.61: C20.2 18.97,35 v18.59,35.38 v17.95,36.01 17.19,36.01 C17.- | v31.16,33.73 29.89,35 R3.1 29.13,35
  Top 1.016: REG5VD.P$2 37.76,36.9 v37.76,43.13 v36.24,43.13
  Bottom 0.254: C29.2 10.74,10.39 10.71,10.36 11.47,10.36 12.5,9.33 USB.5 11.91,8.63 11.6,8.33 11.6,7.18 9.32,4.9 v7.54,4.9 | C40.- 10.84,34.49 C40.- v13.38,34.36 13.63,34.62 U$12.2 13.63,36.27 14.48,37.12 C37.2 | 11.6,31.06 C39.2 | U$13.2 10.84,31.82 11.6,31.06 | v44.11,19.38 44.15,19.34 44.15,18.53 43.99,18.36 44.03,18.32 SPI_0.1 | LT_I2C.1 39.79,21.16 v39.03,21.92 | C38.- 7.79,43.63 v7.28,44.14 | 18.8,31.7 C14.1 19.9,31.53 v20.11,31.32 | C7.1 16.55,29.03 v15.16,29.03 | 11.73,29.5 11.73,29.41 | 11.73,29.5 C30.1 | 11.6,31.06 11.73,30.93 11.73,29.66 | 11.73,29.66 11.73,29.5 | 11.73,29.66 11.73,28.78 v11.35,28.39 | CAM.1 5.47,31.28 5.25,31.06 v5.25,29.16 | 10.2,13.15 C28.2 9.82,13.15 v8.05,14.93 | U$1.59 17.72,26.21 17.19,26.74 v16.68,26.74 16.55,26.74 15.41,25.6 C8.1 | U$1.42 24.06,17.97 24.81,17.22 v25.19,17.22 25.19,16.42 C10.1 | U$1.50 18.26,21.71 17.7,21.15 17.7,20.77 17.44,20.52 14.78,20.52 14.69,20.61 14.69,21.37 | 14.65,21.41 C12.1 | 14.69,21.37 C15.1 | 14.65,21.41 14.69,21.37 | 14.65,21.41 14.4,21.41 13.89,21.92 13,21.92 | C21.2 27.6,36.39 v26.59,37.41 | U$1.6 23.56,29.56 23.03,29.03 v21.25,29.03 | U$1.18 31.49,28.21 31.67,28.39 31.67,29.28 33.58,31.19 34.72,31.19 | C13.1 24.59,34.49 25.95,34.49 26.72,33.73 26.72,32.84 v26.97,32.58 | REG3V3D.4 36.29,43.17 v36.24,43.13 | 13,21.92 12.74,21.92 v12.49,21.66 | U$1.25 34.34,24.71 35.73,26.11 | C36.2 38.18,26.45 v38.27,26.36 | R14.1 46.91,42.62 v46.91,44.02 | UART_1.1 45.8,36.36 v45.89,36.27 | 35.73,26.11 v35.73,27.25 | C11.1 35.61,25.85 35.73,25.98 35.73,26.11 | C9.1 13.04,21.96 13,21.92 | C35.2 38.23,37.37 REG5VD.P$2 | R8.2 18.55,10.91 18.84,10.61 v18.84,10.11
  Bottom 0.254: C34.2 7.34,21.6 v5.63,23.31 | 34.72,31.19 U$8.2 | 34.72,31.19 v34.72,32.97
  Bottom 0.406: C6.- v26.59,43.51 v25.7,43.51 24.83,42.64 C1.-
  Bottom 1.016: REG3V3D.4 36.29,45.37 36.24,45.41 | 36.36,39.2 36.37,39.19 | 36.36,39.2 REG3V3D.2 | REG3V3D.4 36.29,39.27 36.36,39.2 | v36.24,43.13 v37.76,43.13 v37.76,41.6 | GND_IN.P$1 | 37.76,48.71 GND_IN1.P$1 | 37.76,48.71 GND_IN.P$1 | REG3V3D.4 37.24,45.3 37.26,45.28 37.26,48.21 37.76,48.71 | 37.76,48.71 37.76,48.72 GND_IN.P$1 | 36.29,45.28 36.24,45.28 | REG3V3D.4 36.29,45.28 | C3.- 42.21,45.28 36.29,45.28
  other vias: 30.52,34.36 1.44,12.52 1.44,10.74 1.44,8.96 24.43,48.84 25.32,48.84 4.11,12.52 4.11,10.74 4.11,8.96 1.44,14.3
  pour Top (isolate 0.203): 0.04,20.65 22.78,20.65 22.78,13.28 17.95,13.28 17.95,7.18 0.04,7.18
  pour Route2: 49.32,49.35 0.3,49.35 0.3,0.33 49.32,0.33
LED_1  (via drill 0.35)
  Top 0.254: 29.13,3.88 LED1.C v29.13,5.53
  Bottom 0.254: U$1.28 29.54,23.21 29.13,22.81 29.13,20.9 29.89,20.14 29.89,6.3 v29.13,5.53
LED_2  (via drill 0.35)
  Top 0.254: 30.78,3.88 LED2.C v30.78,5.53
  Bottom 0.254: U$1.32 30.41,5.9 v30.78,5.53
LED_3  (via drill 0.35)
  Top 0.254: LED3.C 32.43,5.28 31.16,6.55 v28.62,6.55
  Bottom 0.254: v28.62,6.55 29.38,7.31 29.38,12.14 28.24,13.28 | 28.24,13.28 28.11,13.41 | U$1.36 27.06,14.46 28.24,13.28
LED_4  (via drill 0.35)
  Top 0.254: 34.08,3.88 LED4.C v34.08,5.53 | v33.06,16.33 35.22,16.33 v36.75,14.81
  Bottom 0.254: U$1.20 32.14,27.21 33.06,28.14 35.99,28.14 36.62,27.5 36.62,24.84 36.24,24.46 36.24,15.31 v36.75,14.81 | v34.08,5.53 32.18,7.44 32.18,15.44 v33.06,16.33
LPC_RESET
  Bottom 0.254: U$1.57 17.19,25.21 16.17,24.2 R7.1 14.74,22.97 14.78,22.93 C9.2
LPC_RXD_0  (via drill 0.35)
  Top 0.254: 30.78,19.38 30.65,19.38 | 30.78,19.38 33.32,19.38 38.14,14.55 40.94,14.55 42.2,13.29 GPS.4 45.9,13.29 47.16,14.55 47.16,17.98 v46.27,18.87 | 30.78,19.38 30.02,19.38 v28.37,21.03 | UART_0.6 46.02,38.25 47.16,37.11 v47.16,35
  Route15 0.254: v47.16,35 47.42,34.74 47.42,31.7 43.22,27.5 43.22,24.2 46.27,21.15 v46.27,18.87
  Bottom 0.254: U$1.21 30.4,26.73 30.4,26.74 28.37,26.74 27.48,25.85 27.48,23.31 28.37,22.43 v28.37,21.03
LPC_RXD_1  (via drill 0.35)
  Route15 0.254: v37,22.68 31.03,16.71 v28.37,16.71
  Bottom 0.254: U$1.34 28.06,17.02 v28.37,16.71 | U$8.1 35.87,30.69 35.61,30.43 35.61,29.41 37.13,27.89 37.13,24.58 36.75,24.2 36.75,22.93 v37,22.68
LPC_TXD_0  (via drill 0.35)
  Top 0.254: 43.97,14.54 43.23,14.54 42.21,15.57 38.65,15.57 32.3,21.92 v27.6,21.92 | 43.97,14.54 GPS.5 | 43.97,14.54 45.63,14.54 46.02,14.93 v46.02,17.73 | v46.65,33.09 46.65,34.24 46.27,34.62 46.27,35.51 46.65,35.89 46.65,36.65 46.3,37 UART_0.5
  Route15 0.254: v46.65,33.09 46.65,31.95 42.72,28.01 42.72,23.95 45.77,20.9 45.77,19.63 45.38,19.25 45.38,18.36 v46.02,17.73
  Bottom 0.254: 30.4,27.76 30.4,27.73 U$1.19 28.58,27.71 26.97,26.11 26.97,22.55 v27.6,21.92
LPC_TXD_1  (via drill 0.35)
  Route15 0.254: v28.87,17.73 30.78,17.73 36.75,23.7 v37.51,23.7
  Bottom 0.254: 28.75,17.85 v28.87,17.73 28.56,18.04 U$1.33 | U$8.8 40.67,30.69 40.94,30.43 40.94,26.36 40.05,25.47 37.89,25.47 37.64,25.22 37.64,23.82 v37.51,23.7
LT_I2C_1_SCL  (via drill 0.35)
  Top 0.254: UART_0.3 42.96,34.5 42.72,34.74 41.45,34.74 arc-90 41.32,34.87 | 41.32,34.87 41.32,34.11 v40.94,33.73 | 41.32,34.87 41.32,36.14 40.94,36.52 R44.1
  Route15 0.254: v42.72,29.41 42.72,31.95 v40.94,33.73
  Bottom 0.254: LT_I2C.6 41.77,19.07 43.48,20.77 43.48,22.93 42.72,23.7 v42.72,29.41
LT_I2C_1_SDA  (via drill 0.35)
  Top 0.254: v45.77,33.98 45.77,35.12 45.14,35.75 UART_0.4 42.6,35.75 42.21,36.14 R43.1
  Bottom 0.254: LT_I2C.5 42.42,18.83 43.99,20.39 43.99,23.19 43.22,23.95 43.22,28.27 45.77,30.81 v45.77,33.98
LT_I2C_1_SUP  (via drill 0.35)
  Top 0.254: R44.2 40.94,39.95 41.19,40.2 42.21,40.2 | 42.21,40.2 42.97,40.2 43.99,39.19 45.89,39.19 47.92,37.16 47.92,33.22 46.91,32.2 45.77,32.2 | 42.21,40.2 R43.2 | UART_0.2 45.35,33.25 45.77,32.84 45.77,32.2 | 45.77,32.2 45.77,31.44 44.75,30.43 44.75,29.16 41.57,25.98 41.57,22.17 39.8,20.39 v39.8,19
  Bottom 0.254: 39.2,15.4 39.16,15.44 R25.2 39.2,16.06 | R27.2 39.16,14.04 39.2,14.04 39.2,16.06 | 39.2,16.06 39.2,17.35 | 39.2,17.35 39.2,18.4 v39.8,19 | R26.2 39.11,17.26 39.2,17.35
LT_UART1_LPC_RX
  Bottom 0.254: UART_1.4 42.19,32.61 41.83,32.97 37.38,32.97 37.05,32.63 U$8.4
LT_UART1_LPC_TX
  Bottom 0.254: U$8.5 40.67,32.19 40.69,32.2 41.7,32.2 42.55,31.36 UART_1.5
LT_UART1_SUP  (via drill 0.35)
  Top 0.254: 40.3,29.03 41.07,29.03 42.21,30.17 42.21,32.97 | 42.21,32.97 42.21,33.6 | 40.3,29.03 R24.2 C23.1 | R23.2 40.27,29.07 40.3,29.03 | v42.34,33.86 42.21,33.73 42.21,32.97
  Bottom 0.254: v42.34,33.86 UART_1.3
MAG_RESET
  Bottom 0.254: U$1.4 22.56,31.61 23.54,32.58 23.54,33.86 19.98,37.41 19.98,44.04 IMU.11
MATCH0  (via drill 0.35)
  Top 0.254: v13,29.41 8.43,29.41 6.78,31.06 3.47,31.06 2.58,31.95 v2.58,32.71
  Bottom 0.254: U$1.2 21.56,31.77 20.11,33.22 20.11,33.98 19.48,34.62 18.21,34.62 17.44,33.86 17.44,33.22 16.43,32.2 14.27,32.2 13.89,31.82 13.89,30.04 13.25,29.41 v13,29.41 | CAM.6 4.2,38.26 2.58,36.65 v2.58,32.71
MISO_0  (via drill 0.35)
  Top 0.254: v34.84,12.39 34.84,10.87 35.73,9.98 v36.24,9.98
  Bottom 0.254: SPI_0.6 41.22,12.04 39.16,9.98 v36.24,9.98 | U$1.29 34.43,22.71 34.84,22.3 v34.84,12.39
MISO_1  (via drill 0.35)
  Top 0.254: 17.57,28.01 18.46,27.12 18.46,23.82 v17.32,22.68 | 17.57,28.01 17.32,28.27 | 17.57,28.01 16.68,28.9 v16.68,33.73
  Bottom 0.254: U$1.53 17.85,23.21 v17.32,22.68 | IMU.5 13.59,39.82 14.52,39.82 16.05,38.3 16.05,34.36 v16.68,33.73
MOSI_0  (via drill 0.35)
  Top 0.254: v33.95,14.68 35.1,13.54 40.05,13.54 v40.3,13.28
  Bottom 0.254: v33.95,14.68 33.95,20.39 | 33.95,20.39 33.95,20.52 | SPI_0.5 44.14,13.28 v40.3,13.28 | U$1.30 33.66,22.21 33.95,21.92 33.95,20.39
MOSI_1  (via drill 0.35)
  Top 0.254: v16.68,23.57 17.95,24.84 17.95,26.74 15.92,28.78 15.92,32.97 v15.54,33.35
  Bottom 0.254: v15.54,33.35 15.54,37.92 14.14,39.32 12.33,39.32 IMU.4 | U$1.54 16.83,23.71 v16.68,23.57
N$1  (via drill 0.35)
  Top 0.254: 29.13,1.85 LED1.A v29.13,1.09
  Bottom 0.254: v29.13,1.09 R13.1
N$2
  Bottom 0.254: 17.24,30.75 U$4.P$1 | 17.24,30.75 17.44,30.55 17.44,28.14 17.87,27.71 18.24,27.71 | 18.24,27.71 18,27.71 | 18.24,27.71 U$1.62 | 16.43,30.77 16.43,30.81 | 16.43,30.77 C7.2 | 17.24,30.75 16.43,30.75 16.43,30.77
N$3  (via drill 0.35)
  Top 0.254: R31.2 R32.2 | R31.2 27.6,27 | R31.2 27.73,26.87 | R30.1 24.17,25.6 v24.68,25.09 | R31.2 26.59,27 v26.46,26.87
  Bottom 0.254: v24.68,25.09 25.32,25.09 26.46,26.24 v26.46,26.87
N$4
  Bottom 0.254: 13.05,27.05 13.13,27.12 | 13.05,27.05 U$4.P$3 13.04,27.93 13.25,28.14 16.55,28.14 17.48,27.21 U$1.61 | 13.05,27.05 13.04,27.04 | C8.2 13,25.6 13.05,25.65 13.05,27.05
N$5
  Top 0.254: REG5VD.P$4 41.07,44.02 42.46,42.62 R14.2
N$6  (via drill 0.35)
  Top 0.254: 30.78,1.98 LED2.A v30.78,1.09
  Bottom 0.254: v30.78,1.09 R15.1
N$7  (via drill 0.35)
  Top 0.254: LED3.A v32.43,1.09
  Bottom 0.254: 32.43,2.23 R16.1 v32.43,1.09
N$8
  Top 0.203: U$5.2 11.28,15.64 10.97,15.95 10.97,16.58 11.22,16.84 12.74,16.84 13,17.09 13,17.73 | 16.55,19.76 17.95,19.76 | 17.95,19.76 R5.2 | 17.95,19.76 18.46,19.76 18.84,19.38 18.84,17.73 19.09,17.47 20.62,17.47 20.96,17.13 R10.1 | R20.2 13,17.73 | 13,17.73 13,17.85 14.65,19.5 14.78,19.5 | 14.78,19.5 16.3,19.5 | 14.78,19.5 14.69,19.5 R6.2
  Top 0.254: 16.13,19.46 16.3,19.63 C24.2 16.3,19.5 16.55,19.76
N$9
  Top 0.254: 16.3,17.6 C24.1 16.3,17.73 16.55,17.47 18.08,17.47 | 16.3,17.6 16.81,18.11 | 16.3,17.6 16.55,17.85 | 18.08,17.47 18.08,17.09 18.33,16.84 18.97,16.84 19.22,16.58 R10.2 | 16.3,17.6 16.3,16.96 15.03,15.69 13.63,15.69 13.04,16.29 U$5.1 | R11.1 17.95,18.36 18.08,18.23 18.08,17.47
N$10
  Top 0.203: C26.1 10.71,20.65 10.73,20.66 12.48,20.66 13,20.14 R20.1
  Top 0.254: 10.97,20.27 10.71,20.27 10.33,20.65 | 10.33,20.65 9.32,20.65 9.19,20.77 R21.2 | C26.1 10.37,20.69 10.33,20.65
N$11
  Top 0.254: R30.2 25.06,28.61 25.06,29.54 | 25.06,29.54 U$11.7 25.06,29.54 | 25.06,29.54 U$11.8 | 25.06,29.54
N$12
  Top 0.254: U$3.P$1 20.03,4.72 18.84,5.91 17.57,5.91 16.81,5.15 11.22,5.15 11.09,5.28 11.08,5.27 PS.2
N$13
  Top 0.254: U$3.P$2 16.63,2.66 15.16,4.14 12.24,4.14 11.6,3.5 10.2,3.5 9.82,3.88 9.82,5.28 9.83,5.27 PS.1
N$14
  Bottom 0.254: Q1.C 17.83,14.55 17.06,14.55 16.68,14.17 13.63,14.17 13.25,14.55 R19.2
N$15
  Top 0.254: RC.3 5.49,37.05 5.51,37.03 R12.2
N$16  (via drill 0.35)
  Top 0.254: 34.08,1.85 LED4.A v34.08,1.09
  Bottom 0.254: v34.08,1.09 R22.1
N$17  (via drill 0.35)
  Top 0.254: R23.1 38.56,31.1 38.91,31.44 v41.32,31.44
  Bottom 0.254: 37.01,31.69 U$8.3 | 38.26,31.69 37.01,31.69 | 38.26,31.69 U$8.6 | 37.01,31.69 37,31.7 | 38.26,31.69 41.07,31.69 v41.32,31.44
N$18  (via drill 0.35)
  Top 0.203: R40.1 11.09,18.23 v11.47,18.61
  Top 0.254: U$10.5 10.09,13.39 10.55,12.94 R39.2 10.55,11.34 10.2,11 v7.54,11
  Route15 0.254: v11.47,18.61 13.76,18.61 15.41,16.96 15.41,13.15 13.25,11 v7.54,11
N$20
  Bottom 0.254: LT_I2C.7 41.07,16.96 41.06,16.96 | 41.06,16.96 LT_I2C.8 | R25.1 40.94,15.44 41.06,15.56 41.06,16.96
N$21
  Top 0.254: IC1.1 32.05,11.79 R42.2 R41.2
N$22  (via drill 0.35)
  Top 0.254: LT_I2C1.7 LT_I2C1.8 11.01,27.21 10.2,28.01 v10.2,28.39
  Bottom 0.254: v10.2,28.39 9.02,28.39 R47.1
N$23
  Top 0.254: 15.16,8.84 14.9,8.84 14.93,8.87 | C19.1 15.16,8.84 | REG5VA.4 15.16,10.71 15.16,8.84
N$27  (via drill 0.35)
  Top 0.203: 8.72,15.78 8.3,16.2 8.3,16.96 8.3,18.11
  Top 0.254: R40.2 8.3,18.23 | 8.34,17.05 8.43,16.96 R38.1 8.3,16.96 | 8.72,15.78 U$10.3 | R40.2 8.43,18.23 8.3,18.11 | R40.2 8.68,18.23 v9.95,19.5 | U$9.3 6.78,16.07 6.39,15.69 v3.6,15.69
  Route15 0.254: v3.6,15.69 7.03,15.69 9.95,18.61 v9.95,19.5
N$33
  Top 0.61: R4.1 R3.2 27.86,35 27.86,36.93 REG6V5A.1
OFFSET  (via drill 0.35)
  Top 0.254: v8.94,25.85 9.19,25.6 R21.1 9.19,22.93
  Route15 0.254: v21.51,28.01 22.27,28.78 22.27,29.79 21.51,30.55 11.73,30.55 10.97,29.79 8.55,29.79 7.92,29.16 7.92,26.87 v8.94,25.85
  Bottom 0.254: U$1.9 25.06,28.9 24.17,28.01 v21.51,28.01
PB1_INT  (via drill 0.35)
  Top 0.254: v23.67,11.76 23.67,11.5 24,11.17 U$6.P$1 25.19,10.61 v26.97,8.84
  Bottom 0.254: U$1.45 22.56,13.88 23.67,12.77 v23.67,11.76 23.67,10.07 R35.1 | R48.1 26.5,9.31 v26.97,8.84
PB2  (via drill 0.35)
  Top 0.254: U$7.P$1 22.14,10.23 v20.87,8.96
  Bottom 0.254: 22.14,9.98 R36.1 | 22.14,9.98 22.14,12.77 20.75,14.17 20.75,17.85 21.06,18.17 U$1.48 | 22.14,9.98 21.89,9.98 v20.87,8.96
PB3  (via drill 0.35)
  Top 0.254: 28.11,11.12 U$14.P$1 28.11,11.88 27.86,12.14 25.19,12.14 v24.68,12.65
  Bottom 0.254: U$1.44 23.06,14.27 v24.68,12.65 24.94,12.39 R37.1
PPM_IN  (via drill 0.35)
  Top 0.254: R12.1 10.12,34.02 11.47,35.38 13.76,35.38 v14.65,34.49
  Route15 0.254: v14.65,34.49 14.65,33.09 16.05,31.7 18.33,31.7 20.75,34.11 24.05,34.11 24.56,33.6 v25.7,33.6
  Bottom 0.254: U$1.13 27.06,31.61 26.84,31.82 26.59,31.82 26.21,32.2 26.21,33.09 v25.7,33.6
PPS  (via drill 0.35)
  Top 0.254: GPS.8 41.01,18.29 v40.81,18.49
  Route15 0.254: v40.81,18.49 40.81,14.3 42.72,12.39 42.72,9.72 41.95,8.96 36.75,8.96 36.24,8.46 32.56,8.46 31.8,9.22 v28.11,9.22
  Bottom 0.254: R48.2 28.2,9.31 v28.11,9.22
PRESSURE  (via drill 0.35)
  Top 0.254: C25.1 21.38,14.93 22.27,15.82 22.27,17.22 v21.76,17.73 21.13,18.36 R11.2
  Route15 0.254: v28.87,15.69 23.79,15.69 v21.76,17.73
  Bottom 0.254: U$1.35 27.56,16.25 28.11,15.69 v28.87,15.69
PRESSURE_RAW
  Top 0.254: U$2.P$4 2.2,15.69 2.58,15.31 | 2.58,15.31 2.91,14.99 | U$5.3 9.88,14.99 9.57,14.68 9.57,13.66 9.19,13.28 8.17,13.28 7.92,13.54 | 7.92,13.54 7.28,14.17 | 7.28,14.97 7.28,14.18 7.92,13.54 | 7.28,14.97 U$9.4 | 7.28,14.97 2.93,14.97 2.58,15.31
PSW_1
  Bottom 0.254: 8.05,34.49 C40.+ | U$13.1 9.76,32.77 11.54,32.77 11.6,32.84 C39.1 | 5.38,34.49 5.42,34.53 CAM.3
  Bottom 0.406: 9.76,32.77 8.05,34.49 5.38,34.49
PSW_2
  Bottom 0.254: 5.48,35.63 CAM.4 | U$12.1 12.65,35.63 12.65,37.25 12.62,37.28 C37.1
  Bottom 0.406: 5.48,35.63 8.05,35.63 | 8.05,35.63 12.65,35.63 | C38.+ 7.79,38.94 8.05,38.68 8.05,35.63
PWM5  (via drill 0.35)
  Top 0.254: v14.02,28.9 14.02,29.66 11.47,32.2 v3.6,32.2
  Bottom 0.254: U$1.1 21.06,31.51 19.6,32.97 19.6,33.73 19.22,34.11 18.46,34.11 17.95,33.6 17.95,32.97 16.68,31.7 14.65,31.7 14.4,31.44 14.4,29.28 v14.02,28.9 | CAM.5 4.09,37.01 3.6,36.52 v3.6,32.2
PWR_SW  (via drill 0.35)
  Route15 0.254: v24.05,28.9 20.87,32.08 19.6,32.08 18.71,31.19 15.54,31.19 v13.63,33.09
  Bottom 0.254: U$12.4 13.73,33.19 v13.63,33.09 | U$1.8 24.56,29.41 v24.05,28.9
SCK_0
  Bottom 0.254: U$1.27 35.2,23.71 35.73,23.19 35.73,12.14 34.97,11.38 34.97,9.85 35.61,9.22 39.29,9.22 40.86,10.79 SPI_0.7
SCK_1  (via drill 0.35)
  Top 0.254: v20.75,22.81 20.11,22.81 18.97,23.95 18.97,27.38 17.57,28.78 17.57,34.24 v16.94,34.87
  Bottom 0.254: U$1.47 21.56,21.99 v20.75,22.81 | IMU.6 16.55,38.63 16.55,35.25 v16.94,34.87
SCL_0  (via drill 0.35)
  Top 0.254: U$11.3 28.18,30.88 27.73,30.43 27.73,28.27 | 27.73,28.27 R29.2 | 27.73,28.27 26.33,28.27 25.7,27.63 25.7,26.36 26.72,25.35 26.72,24.71 26.97,24.46 v28.87,24.46
  Bottom 0.254: U$1.22 29.11,26.21 28.87,25.98 v28.87,24.46
SCL_0_TRANSLATED  (via drill 0.35)
  Top 0.254: 39.8,5.41 MC2.2 39.79,5.52 39.8,5.53 v39.8,8.07 | MC3.2 9.83,44.15 9.82,44.14 v9.82,41.47 | 26.21,22.17 26.21,19.38 27.48,18.11 27.48,14.42 30.02,11.88 30.02,9.6 31.54,8.07 v39.8,8.07 | 26.21,22.17 26.21,22.3 | v27.98,32.71 27.98,32.46 26.41,30.88 U$11.6 23.86,30.88 23.29,30.3 23.29,25.22 25.06,23.44 25.44,23.44 26.21,22.68 26.21,22.17 | v39.8,8.07 R45.2
  Bottom 0.254: 11.08,44.15 11.09,44.14 | 11.08,44.15 MC4.2 | 11.08,44.15 11.08,45.55 10.84,45.79 9.44,45.79 8.94,45.28 8.94,42.36 v9.82,41.47 11.73,41.47 18.21,47.95 19.09,47.95 20.49,46.55 20.49,37.67 22.65,35.51 25.7,35.51 27.22,33.98 27.22,33.47 v27.98,32.71 | MC1.2 37.93,5.49 37.38,6.04 37.38,7.69 37.76,8.07 v39.8,8.07
SCL_1  (via drill 0.35)
  Top 0.254: GPS.6 42.87,15.79 42.59,16.07 38.91,16.07 37,17.98 v37,20.14 34.46,22.68 27.22,22.68 26.72,22.17 26.72,21.28 v26.97,21.03 | IC1.6 37.19,9.91 36.88,9.6 36.88,9.34 36.62,9.09 35.1,9.09 34.21,9.98 v34.21,10.23 | LT_I2C1.3 6.85,25.91 6.27,26.49 v5.89,26.49
  Route15 0.254: v26.97,21.03 26.97,20.27 25.95,19.25 12.11,19.25 8.43,22.93 7.54,22.93 6.65,23.82 6.65,24.84 7.16,25.35 7.16,25.85 6.52,26.49 v5.89,26.49 | v37,20.14 35.86,19 35.86,14.04 35.1,13.28 34.59,13.28 33.95,12.65 33.95,10.49 v34.21,10.23
  Bottom 0.254: v37,20.14 37.76,20.9 39.16,20.9 40.43,19.63 41.32,19.63 41.77,20.08 LT_I2C.3 41.77,22.61 41.15,23.23 R33.1 | U$1.37 26.56,20.62 v26.97,21.03
SDA_0  (via drill 0.35)
  Top 0.254: R28.2 29.25,32.58 29.26,32.58 U$11.4 27.94,31.53 26.33,29.92 26.33,29.03 25.19,27.89 25.19,26.11 26.21,25.09 26.21,24.46 26.59,24.08 26.97,23.7 34.59,23.7 34.97,24.08 v35.35,24.46
  Bottom 0.254: U$1.26 35.11,24.21 v35.35,24.46
SDA_0_TRANSLATED  (via drill 0.35)
  Top 0.254: 37.13,7.18 v38.53,7.18 v38.54,7.18 MC2.1 38.54,4.38 38.91,4.01 40.43,4.01 41.36,4.94 R46.2 | 37.13,7.18 37,7.18 | MC3.1 v11.08,42.48 v11.09,42.49 | v27.98,33.73 26.97,33.73 26.21,32.97 26.21,31.95 | 26.21,31.95 26.21,31.82 | 26.21,31.95 26.21,31.83 25.91,31.53 U$11.5 23.63,31.53 22.78,30.68 22.78,24.96 24.56,23.19 24.56,20.27 26.97,17.85 26.97,14.17 29.51,11.63 29.51,9.34 31.67,7.18 37.13,7.18
  Bottom 0.254: v38.53,7.18 39.29,7.18 39.8,6.68 39.8,5.53 39.79,5.52 MC1.1 | v27.98,33.73 27.98,34.11 26.08,36.01 22.91,36.01 21,37.92 21,46.81 19.35,48.46 17.95,48.46 11.98,42.49 v11.09,42.49 10.08,42.49 9.82,42.74 9.82,44.14 9.83,44.15 MC4.1
SSEL_0  (via drill 0.35)
  Top 0.254: v31.8,20.27 33.19,20.27 38.4,15.06 41.57,15.06 v42.08,14.55
  Bottom 0.254: SPI_0.4 44.14,14.55 v42.08,14.55 | U$1.31 31.62,21.71 31.8,21.54 v31.8,20.27
SSEL_1  (via drill 0.35)
  Top 0.254: v20.75,23.82 20.75,24.84 21.63,25.73 21.63,26.36 18.97,29.03 18.97,31.44 19.6,32.08 21.89,32.08 v22.14,32.33
  Bottom 0.254: U$1.55 19.22,24.2 20.36,24.2 v20.75,23.82 | v22.14,32.33 21.76,32.33 20.62,33.47 20.62,34.49 18.33,36.78 17.32,36.78 17.06,37.03 17.06,38.94 15.41,40.59 15.41,41.54 IMU.7
SSEL_2  (via drill 0.35)
  Top 0.254: v20.75,25.98 20.75,26.36 18.46,28.65 18.46,31.82 19.48,32.84 21.25,32.84 v21.76,33.35
  Bottom 0.254: v21.76,33.35 21.76,34.11 18.97,36.9 18.97,39.75 IMU.8 | U$1.60 20.39,26.71 20.75,26.36 v20.75,25.98
SSEL_EEP  (via drill 0.35)
  Top 0.254: IMU.12 19.73,46.06 19.73,45.16 16.3,41.73 v16.3,41.09
  Route15 0.254: v18.84,33.35 19.6,34.11 19.6,36.27 v17.95,37.92
  Bottom 0.254: U$1.64 18.14,28.71 17.95,28.9 17.95,32.2 18.84,33.09 v18.84,33.35 | v17.95,37.92 17.95,39.44 v16.3,41.09
USB+
  Bottom 0.254: USB.3 14.11,9.89 13.89,10.11 12.49,10.11 12.11,10.49 12.11,11.38 11.63,11.86 R17.2
USB-
  Bottom 0.254: R18.2 14.9,11.25 14.91,11.25 USB.2
USB_CONNECT  (via drill 0.35)
  Top 0.254: v23.79,22.55 24.05,22.3 24.05,19.76 24.43,19.38 24.43,13.66 22.78,12.01 20.87,12.01 v20.49,11.63
  Bottom 0.254: v23.79,22.55 23.79,25.35 27.16,28.71 U$1.17 | 17.06,16.46 16.94,16.58 | Q1.B 16.88,16.64 17.06,16.46 | 17.06,16.46 17.06,16.07 17.32,15.82 18.59,15.82 19.73,14.68 19.73,13.66 20.49,12.9 v20.49,11.63
USB_N  (via drill 0.35)
  Top 0.254: v23.03,23.57 23.03,22.17 23.54,21.66 23.54,18.61 23.92,18.23 23.92,13.92 22.52,12.52 19.73,12.52 v19.6,12.39
  Bottom 0.254: v23.03,23.57 23.03,25.35 26.06,28.37 U$1.11 | R18.1 13.13,11.25 13.21,11.34 C28.1 14.78,13.15 15.16,13.54 18.59,13.54 19.6,12.52 v19.6,12.39
USB_P  (via drill 0.35)
  Top 0.254: v21.51,24.58 21.76,24.33 21.76,19.63 23.41,17.98 23.41,14.17 22.4,13.15 19.22,13.15 18.84,12.77 18.84,12.01 20.49,10.36 v20.49,10.11
  Route15 0.254: v20.49,10.11 21,10.11 21.76,9.34 21.76,6.93 20.75,5.91 17.57,5.91 16.81,5.15 9.19,5.15 v8.3,6.04
  Bottom 0.254: 9.08,10.64 C29.1 | 9.08,10.64 9.06,10.61 | 9.08,12.11 9.06,12.14 | C29.1 9.06,10.36 | U$1.10 25.56,28.64 v21.51,24.58 | R17.1 9.06,11.88 9.08,11.9 | R19.1 11.51,15.4 11.22,15.69 7.66,15.69 7.16,15.19 7.16,14.42 9.08,12.5 9.08,12.11 | v8.3,6.04 6.65,7.69 6.65,9.34 7.41,10.11 8.55,10.11 9.08,10.64 | R17.1 9.08,12.11 | C29.1 R17.1 | R17.1 | R17.1 9.08,12.11
USB_VBUS
  Bottom 0.254: 16.27,10.71 16.3,10.74 | 16.27,10.71 R9.1 | USB.1 15.7,10.14 16.27,10.71
USB_VBUS_3V3  (via drill 0.35)
  Top 0.254: v13.38,21.03 13.38,22.43 v16.68,25.73
  Bottom 0.254: 16.55,12.65 16.53,12.62 R9.2 16.3,12.65 17.67,12.65 | 17.67,12.65 17.7,12.65 R8.1 | 17.67,12.65 R8.1 | U$1.58 16.69,25.71 v16.68,25.73 | 15.92,18.61 16.3,18.61 | 15.92,18.61 14.02,18.61 13.38,19.25 v13.38,21.03 | 15.92,18.61 19.6,18.61 20.24,17.98 20.24,14.68 20.24,13.92 21.38,12.77 21.38,11.25 21,10.87 19.6,10.87 18.71,11.76 18.71,12.39 18.5,12.61 R8.1
VBAT_MEAS  (via drill 0.35)
  Top 0.254: 36.84,30.77 36.84,29.96 36.88,29.92 R1.1 36.84,30.77 | 36.84,30.77 R2.2 | v33.7,32.2 33.7,31.44 34.33,30.81 36.8,30.81 36.84,30.77
  Bottom 0.254: U$1.14 27.56,29.58 27.86,29.28 28.75,29.28 29.25,29.79 31.29,29.79 v33.7,32.2

## Text on the board
Document: POWER | MOTORS | SERVO/LED/CAM | RC | I2C_1 | UART_0 | ADC | GPS | USB | SPI_0 | MOTORS
dxf: 62
tDocu: SS2 | (+) | (-) | MRST | DRDY1 | DRDY0 | SS1 | SS0 | front | SCK | MOSI | MISO | +6V5 | GND | GND | Quadrotor Controller v1.1 | 2009/5 | SDA | SCL | A | B | C | 1 | 2 | 3 | 4
bDocu: (+) | (-) | SDA | SCL